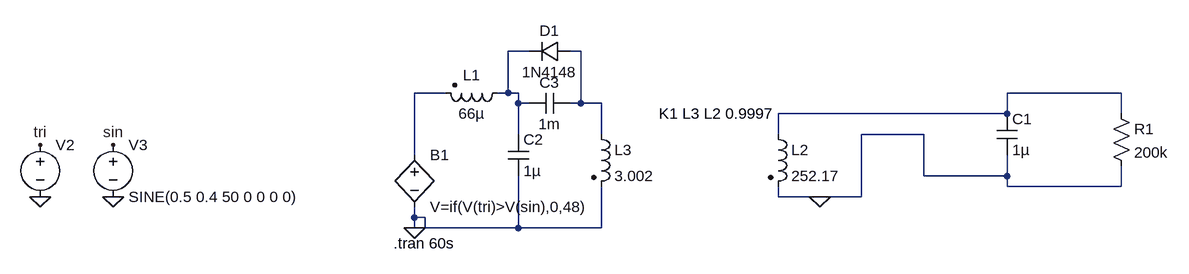
[diagram p0: schematic Draft4.asc]
Draft4.asc, the LTspice schematic file:
Version 4
SHEET 1 1168 680
WIRE 160 -48 128 -48
WIRE 240 -48 224 -48
WIRE 32 16 -16 16
WIRE 128 16 128 -48
WIRE 128 16 112 16
WIRE 144 16 128 16
WIRE 1072 16 896 16
WIRE 144 32 144 16
WIRE 160 32 144 32
WIRE 240 32 240 -48
WIRE 240 32 224 32
WIRE 272 32 240 32
WIRE 896 48 896 16
WIRE 896 48 544 48
WIRE 1072 48 1072 16
WIRE 144 80 144 32
WIRE 272 80 272 32
WIRE 544 80 544 48
WIRE 768 80 672 80
WIRE -16 112 -16 16
WIRE 768 144 768 80
WIRE 896 144 896 112
WIRE 896 144 768 144
WIRE 896 160 896 144
WIRE 1072 160 1072 128
WIRE 1072 160 896 160
WIRE 544 176 544 160
WIRE 608 176 544 176
WIRE 672 176 672 80
WIRE 672 176 608 176
WIRE -16 208 -16 192
WIRE 0 208 -16 208
WIRE -16 224 -16 208
WIRE 0 224 0 208
WIRE 144 224 144 144
WIRE 144 224 0 224
WIRE 272 224 272 160
WIRE 272 224 144 224
FLAG -16 224 0
FLAG -592 176 0
FLAG -592 96 tri
FLAG -480 176 0
FLAG -480 96 sin
FLAG 608 176 0
SYMBOL ind2 528 64 R0
SYMATTR InstName L2
SYMATTR Value 252.17
SYMATTR Type ind
SYMATTR SpiceLine Rser=10
SYMBOL cap 880 48 R0
SYMATTR InstName C1
SYMATTR Value 1µ
SYMATTR SpiceLine Rser=10m Rpar=100k
SYMBOL res 1056 32 R0
SYMATTR InstName R1
SYMATTR Value 200k
SYMBOL voltage -592 80 R0
WINDOW 3 24 96 Invisible 2
WINDOW 123 0 0 Left 0
WINDOW 39 0 0 Left 0
SYMATTR Value PULSE(0 1 0 10u 10u 0u 20u)
SYMATTR InstName V2
SYMBOL voltage -480 80 R0
WINDOW 123 0 0 Left 0
WINDOW 39 0 0 Left 0
SYMATTR InstName V3
SYMATTR Value SINE(0.5 0.4 50 0 0 0 0)
SYMBOL bv -16 96 R0
SYMATTR InstName B1
SYMATTR Value V=if(V(tri)>V(sin),0,48)
SYMBOL ind2 128 0 R90
WINDOW 0 4 56 VBottom 2
WINDOW 3 32 56 VTop 2
SYMATTR InstName L1
SYMATTR Value 66µ
SYMATTR Type ind
SYMATTR SpiceLine Ipk=27 Rser=1m
SYMBOL cap 128 80 R0
SYMATTR InstName C2
SYMATTR Value 1µ
SYMATTR SpiceLine V=250
SYMBOL ind2 256 64 R0
SYMATTR InstName L3
SYMATTR Value 3.002
SYMATTR Type ind
SYMATTR SpiceLine Rser=0.2
SYMBOL cap 224 16 R90
WINDOW 0 0 32 VBottom 2
WINDOW 3 32 32 VTop 2
SYMATTR InstName C3
SYMATTR Value 1m
SYMATTR SpiceLine V=50v Rser=1m
SYMBOL diode 224 -64 R90
WINDOW 0 0 32 VBottom 2
WINDOW 3 32 32 VTop 2
SYMATTR InstName D1
SYMATTR Value 1N4148
TEXT 360 48 Left 2 !K1 L3 L2 0.9997
TEXT -48 248 Left 2 !.tran 60s

The netlist it stands for:
* Draft4.asc
L2 N004 0 252.17 Rser=10
C1 N004 0 1µ Rser=10m Rpar=100k
R1 N004 0 200k
V2 tri 0 PULSE(0 1 0 10u 10u 0u 20u)
V3 sin 0 SINE(0.5 0.4 50 0 0 0 0)
B1 N003 0 V=if(V(tri)>V(sin),0,48)
L1 N001 N003 66µ Ipk=27 Rser=1m
C2 N001 0 1µ V=250
L3 N002 0 3.002 Rser=0.2
C3 N002 N001 1m V=50v Rser=1m
D1 N002 N001 1N4148
.model D D
.lib standard.dio
K1 L3 L2 0.9997
.tran 60s
.backanno
.end